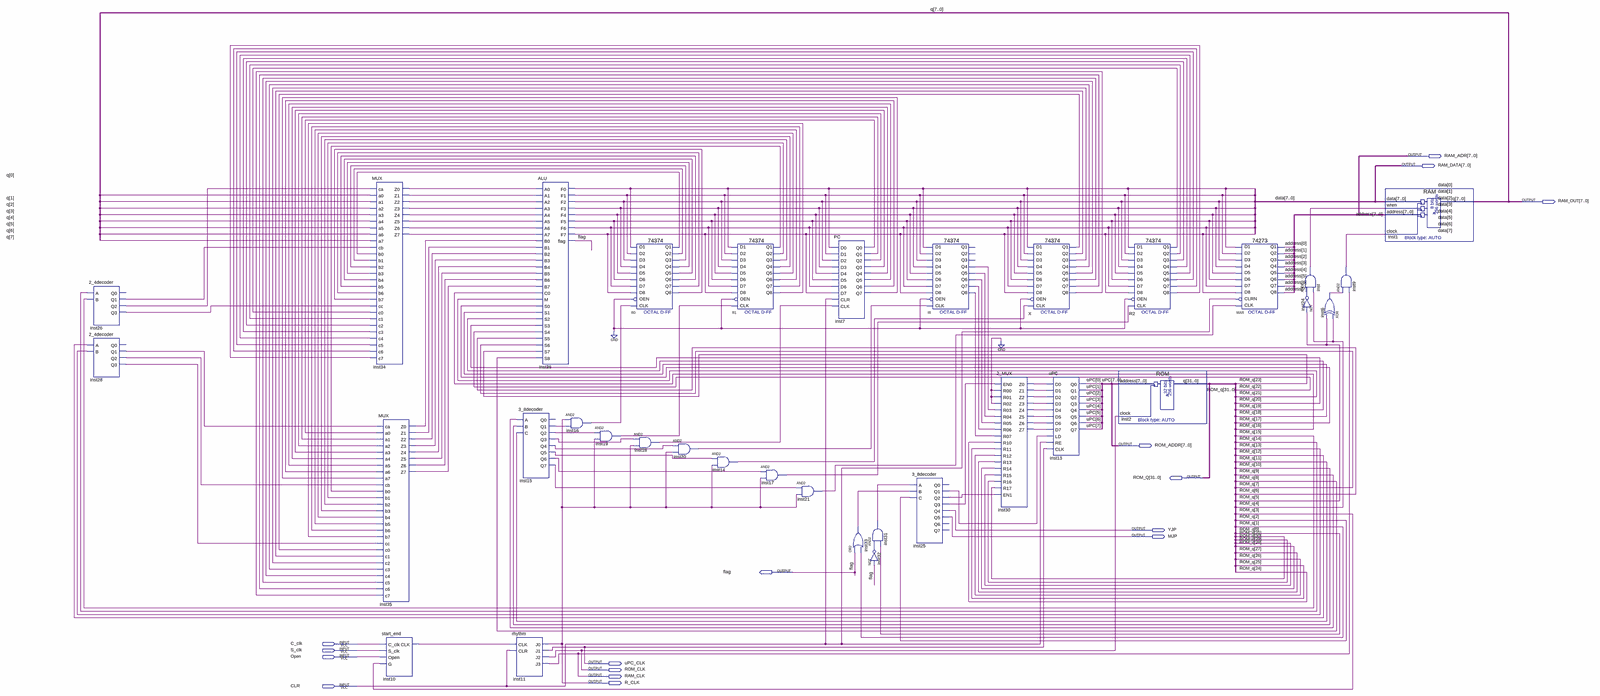
[diagram p0: schematic sheet, whole]
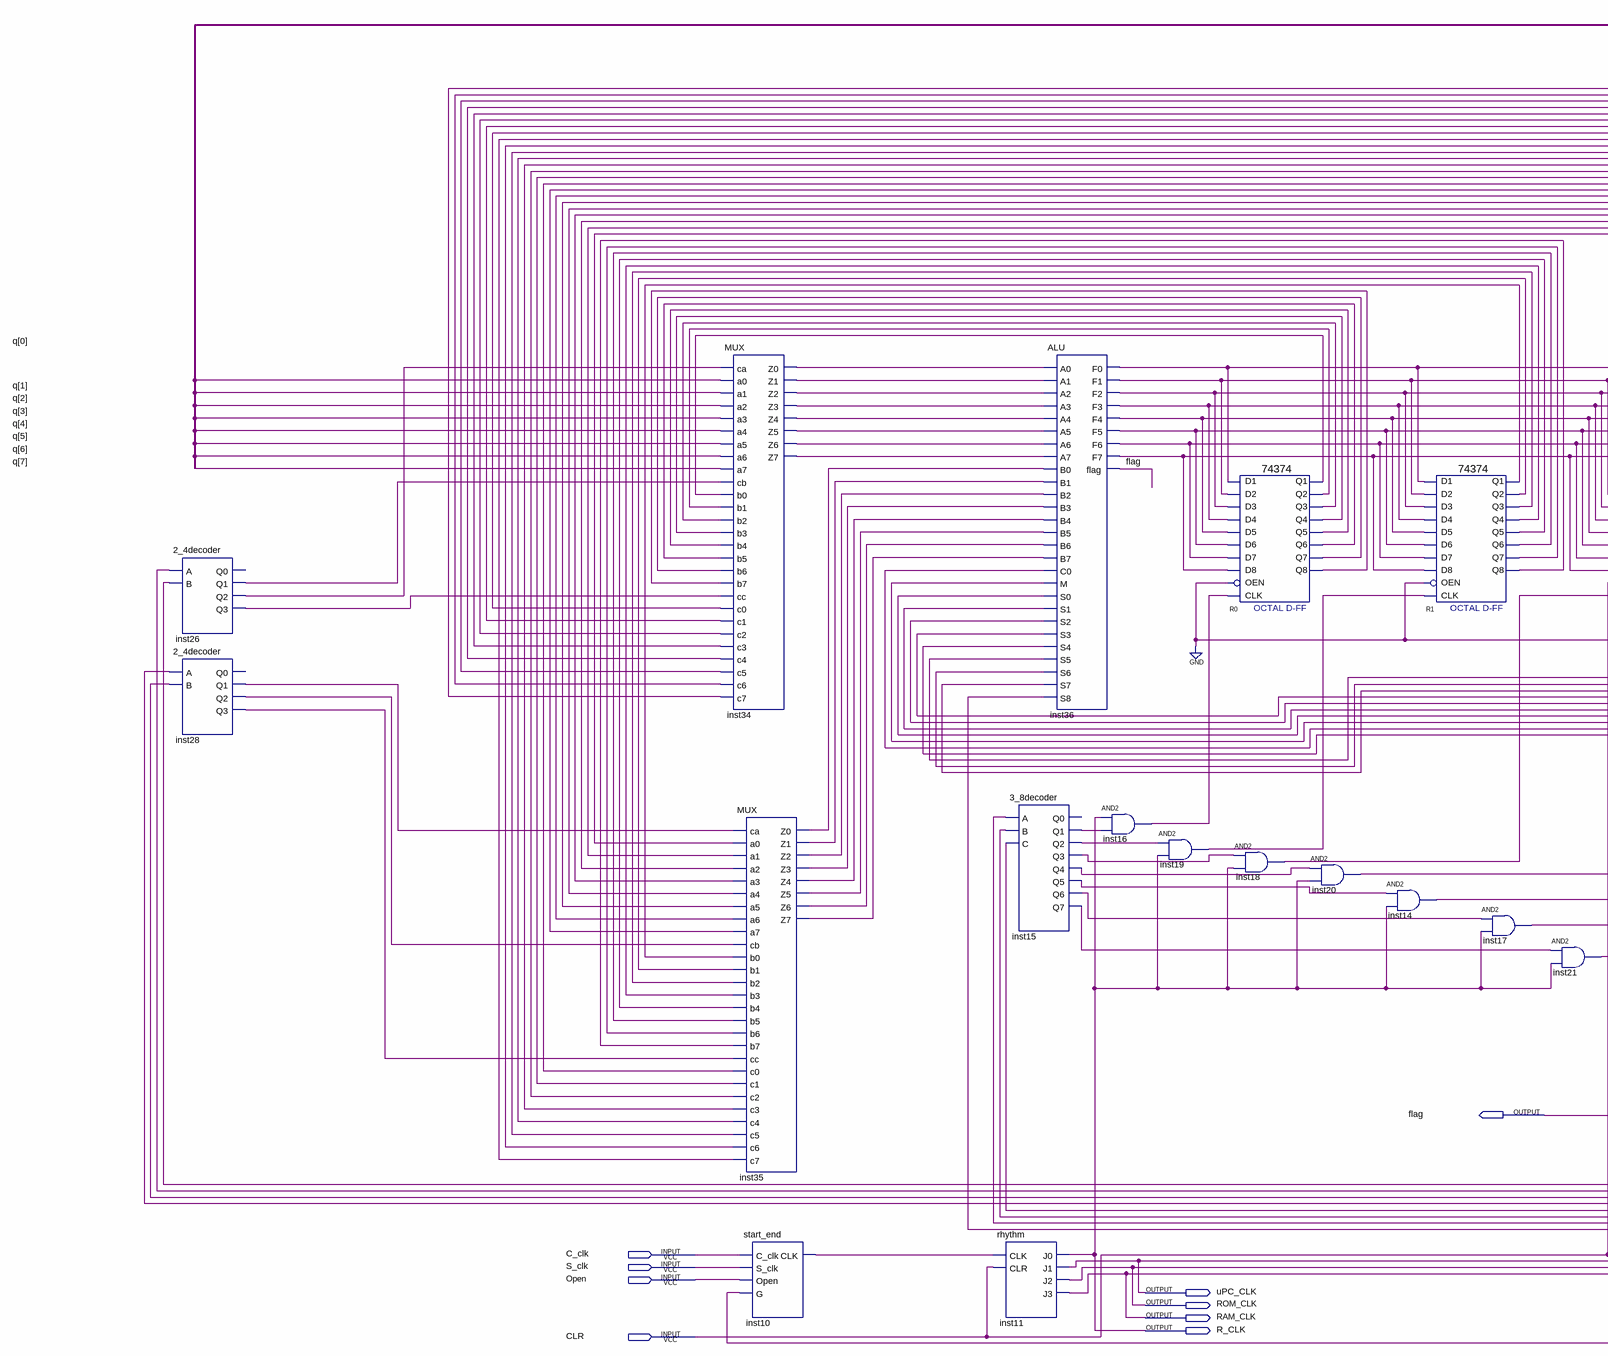
[diagram p1: schematic sheet, left part]
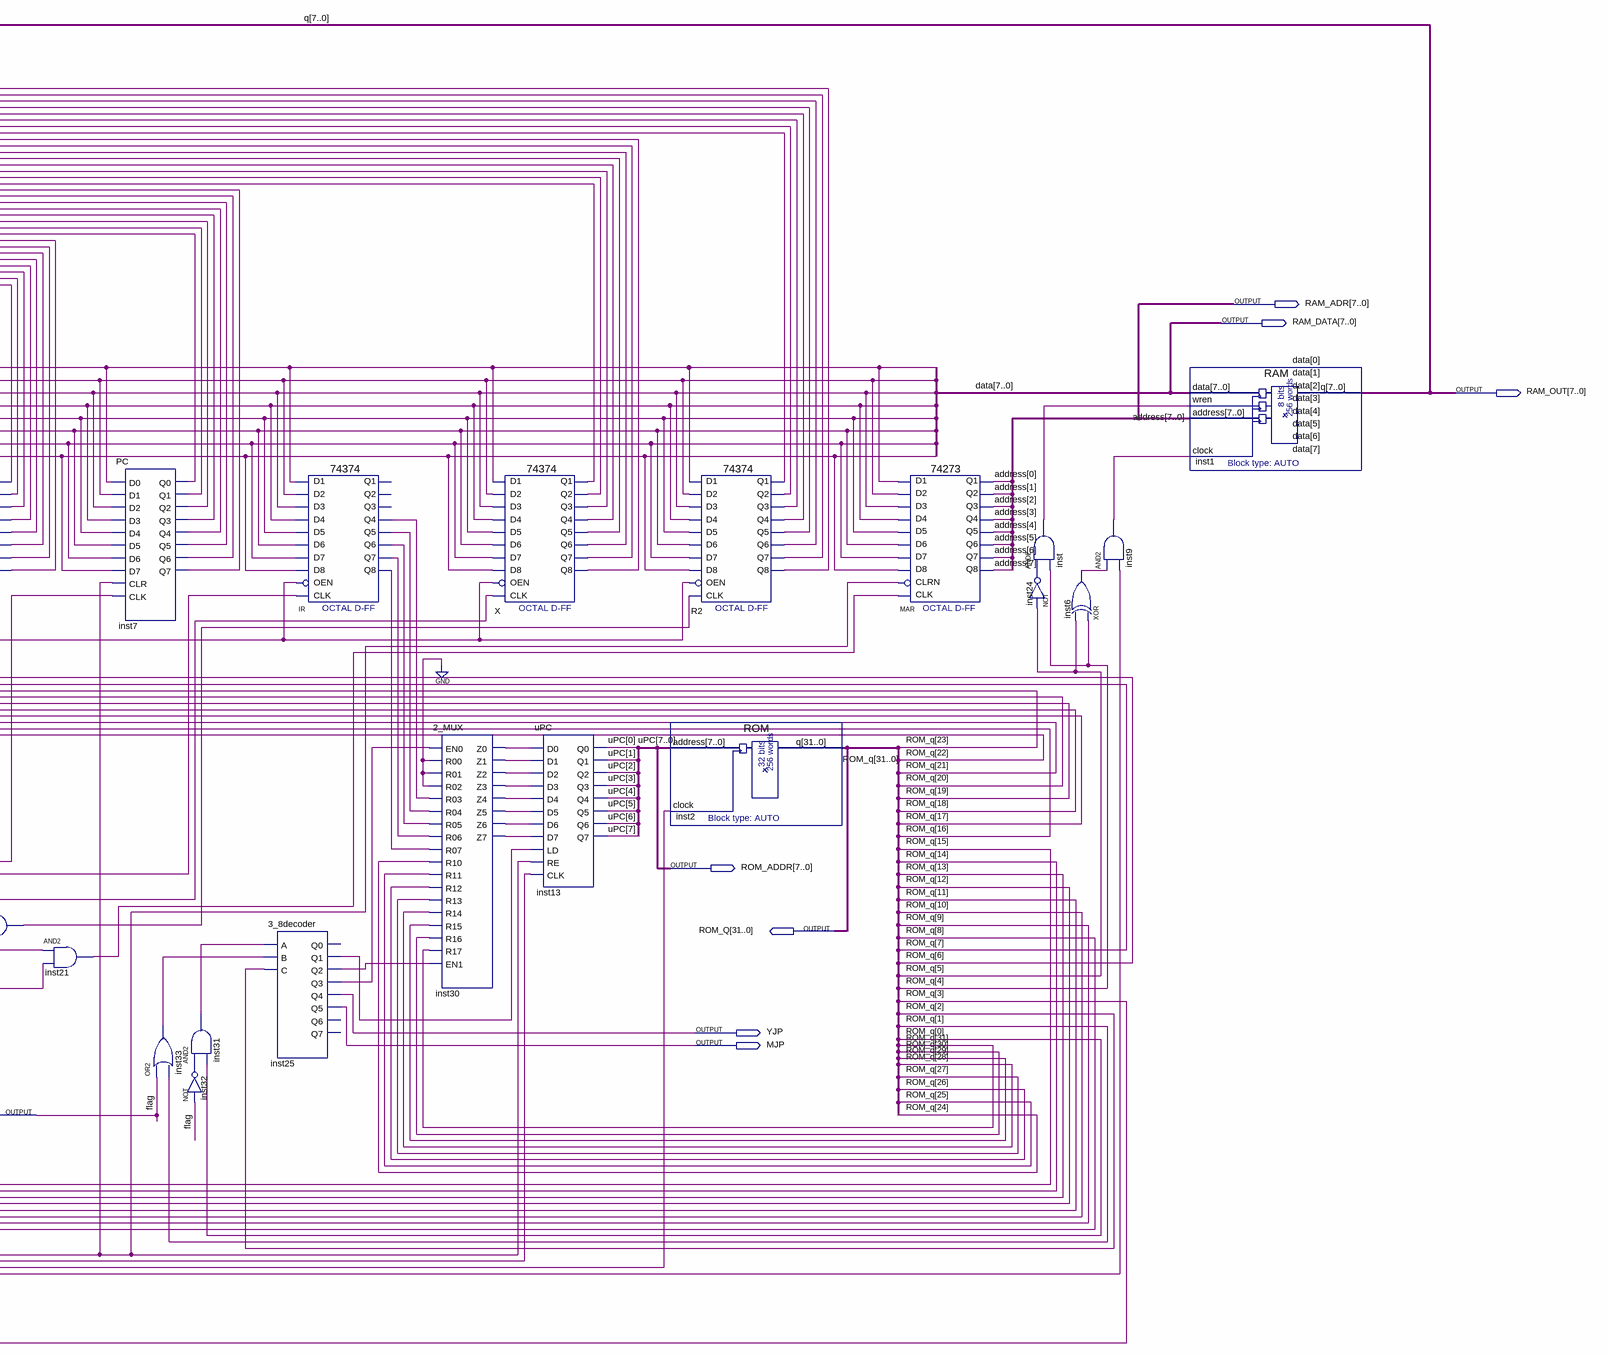
[diagram p2: schematic sheet, right part]
// Quartus schematic T3.bdf as structural Verilog: 34 symbols, 16 pins
module T3 (
  input  C_clk,
  input  S_clk,
  input  Open,
  input  CLR,
  output [7:0] RAM_ADR,
  output [7:0] RAM_DATA,
  output [7:0] RAM_OUT,
  output [7:0] ROM_ADDR,
  output [31:0] ROM_Q,
  output YJP,
  output MJP,
  output flag,
  output uPC_CLK,
  output ROM_CLK,
  output RAM_CLK,
  output R_CLK
);

  wire inst6_out, inst7_q0, inst7_q1, inst7_q2, inst7_q3, inst7_q4, inst7_q5, inst7_q6, inst7_q7, inst9_out,
       inst10_clk, inst14_out, inst15_q1, inst15_q2, inst15_q3, inst15_q4, inst15_q5, inst15_q6, inst15_q7,
       inst16_out, inst17_out, inst18_out, inst19_out, inst20_out, inst21_out, inst24_out, inst25_q1,
       inst25_q2, inst25_q3, inst26_q1, inst26_q2, inst26_q3, inst28_q1, inst28_q2, inst28_q3, inst30_z0,
       inst30_z1, inst30_z2, inst30_z3, inst30_z4, inst30_z5, inst30_z6, inst30_z7, inst31_out, inst32_out,
       inst33_out, inst34_z0, inst34_z1, inst34_z2, inst34_z3, inst34_z4, inst34_z5, inst34_z6, inst34_z7,
       inst35_z0, inst35_z1, inst35_z2, inst35_z3, inst35_z4, inst35_z5, inst35_z6, inst35_z7, inst_out,
       IR_q4, IR_q5, IR_q6, IR_q7, IR_q8, R0_q1, R0_q2, R0_q3, R0_q4, R0_q5, R0_q6, R0_q7, R0_q8, R1_q1,
       R1_q2, R1_q3, R1_q4, R1_q5, R1_q6, R1_q7, R1_q8, R2_q1, R2_q2, R2_q3, R2_q4, R2_q5, R2_q6, R2_q7,
       R2_q8, X_q1, X_q2, X_q3, X_q4, X_q5, X_q6, X_q7, X_q8;

  \2_4decoder  inst26 (.A(ROM_Q[14]), .B(ROM_Q[15]), .Q1(inst26_q1), .Q2(inst26_q2), .Q3(inst26_q3));  // open: Q0
  \2_4decoder  inst28 (.A(ROM_Q[12]), .B(ROM_Q[13]), .Q1(inst28_q1), .Q2(inst28_q2), .Q3(inst28_q3));  // open: Q0
  MUX inst34 (
    .ca(inst26_q2), .a0(RAM_OUT[0]), .a1(RAM_OUT[1]), .a2(RAM_OUT[2]), .a3(RAM_OUT[3]), .a4(RAM_OUT[4]),
    .a5(RAM_OUT[5]), .a6(RAM_OUT[6]), .a7(RAM_OUT[7]), .cb(inst26_q1), .b0(R0_q1), .b1(R0_q2), .b2(R0_q3),
    .b3(R0_q4), .b4(R0_q5), .b5(R0_q6), .b6(R0_q7), .b7(R0_q8), .cc(inst26_q3), .c0(R2_q1), .c1(R2_q2),
    .c2(R2_q3), .c3(R2_q4), .c4(R2_q5), .c5(R2_q6), .c6(R2_q7), .c7(R2_q8), .Z0(inst34_z0), .Z1(inst34_z1),
    .Z2(inst34_z2), .Z3(inst34_z3), .Z4(inst34_z4), .Z5(inst34_z5), .Z6(inst34_z6), .Z7(inst34_z7));
  MUX inst35 (
    .ca(inst28_q1), .a0(inst7_q0), .a1(inst7_q1), .a2(inst7_q2), .a3(inst7_q3), .a4(inst7_q4), .a5(inst7_q5),
    .a6(inst7_q6), .a7(inst7_q7), .cb(inst28_q2), .b0(R1_q1), .b1(R1_q2), .b2(R1_q3), .b3(R1_q4), .b4(R1_q5),
    .b5(R1_q6), .b6(R1_q7), .b7(R1_q8), .cc(inst28_q3), .c0(X_q1), .c1(X_q2), .c2(X_q3), .c3(X_q4),
    .c4(X_q5), .c5(X_q6), .c6(X_q7), .c7(X_q8), .Z0(inst35_z0), .Z1(inst35_z1), .Z2(inst35_z2),
    .Z3(inst35_z3), .Z4(inst35_z4), .Z5(inst35_z5), .Z6(inst35_z6), .Z7(inst35_z7));
  start_end inst10 (.C_clk(C_clk), .S_clk(S_clk), .Open(Open), .G(ROM_Q[3]), .CLK(inst10_clk));
  \3_8decoder  inst15 (
    .A(ROM_Q[9]), .B(ROM_Q[10]), .C(ROM_Q[11]), .Q1(inst15_q1), .Q2(inst15_q2), .Q3(inst15_q3),
    .Q4(inst15_q4), .Q5(inst15_q5), .Q6(inst15_q6), .Q7(inst15_q7));  // open: Q0
  rhythm inst11 (.CLK(inst10_clk), .CLR(CLR), .J0(R_CLK), .J1(uPC_CLK), .J2(ROM_CLK), .J3(RAM_CLK));
  ALU inst36 (
    .A0(inst34_z0), .A1(inst34_z1), .A2(inst34_z2), .A3(inst34_z3), .A4(inst34_z4), .A5(inst34_z5),
    .A6(inst34_z6), .A7(inst34_z7), .B0(inst35_z0), .B1(inst35_z1), .B2(inst35_z2), .B3(inst35_z3),
    .B4(inst35_z4), .B5(inst35_z5), .B6(inst35_z6), .B7(inst35_z7), .C0(ROM_Q[16]), .M(ROM_Q[21]),
    .S0(ROM_Q[17]), .S1(ROM_Q[18]), .S2(ROM_Q[19]), .S3(ROM_Q[20]), .S4(ROM_Q[22]), .S5(ROM_Q[6]),
    .S6(ROM_Q[7]), .S7(ROM_Q[23]), .S8(ROM_Q[8]), .F0(RAM_DATA[0]), .F1(RAM_DATA[1]), .F2(RAM_DATA[2]),
    .F3(RAM_DATA[3]), .F4(RAM_DATA[4]), .F5(RAM_DATA[5]), .F6(RAM_DATA[6]), .F7(RAM_DATA[7]), .flag(flag));
  and inst16 (inst16_out, R_CLK, inst15_q1);
  and inst19 (inst19_out, inst15_q2, R_CLK);
  \74374  R0 (
    .D1(RAM_DATA[0]), .D2(RAM_DATA[1]), .D3(RAM_DATA[2]), .D4(RAM_DATA[3]), .D6(RAM_DATA[5]),
    .D5(RAM_DATA[4]), .OEN(1'b0), .D8(RAM_DATA[7]), .D7(RAM_DATA[6]), .CLK(inst16_out), .Q2(R0_q2),
    .Q3(R0_q3), .Q5(R0_q5), .Q4(R0_q4), .Q6(R0_q6), .Q7(R0_q7), .Q8(R0_q8), .Q1(R0_q1));
  and inst18 (inst18_out, inst15_q3, R_CLK);
  and inst20 (inst20_out, inst15_q4, R_CLK);
  and inst14 (inst14_out, inst15_q5, R_CLK);
  \74374  R1 (
    .D1(RAM_DATA[0]), .D2(RAM_DATA[1]), .D3(RAM_DATA[2]), .D4(RAM_DATA[3]), .D6(RAM_DATA[5]),
    .D5(RAM_DATA[4]), .OEN(1'b0), .D8(RAM_DATA[7]), .D7(RAM_DATA[6]), .CLK(inst19_out), .Q2(R1_q2),
    .Q3(R1_q3), .Q5(R1_q5), .Q4(R1_q4), .Q6(R1_q6), .Q7(R1_q7), .Q8(R1_q8), .Q1(R1_q1));
  and inst17 (inst17_out, inst15_q6, R_CLK);
  and inst21 (inst21_out, inst15_q7, R_CLK);
  PC inst7 (
    .D0(RAM_DATA[0]), .D1(RAM_DATA[1]), .D2(RAM_DATA[2]), .D3(RAM_DATA[3]), .D4(RAM_DATA[4]),
    .D5(RAM_DATA[5]), .D6(RAM_DATA[6]), .D7(RAM_DATA[7]), .CLR(CLR), .CLK(inst18_out), .Q0(inst7_q0),
    .Q1(inst7_q1), .Q2(inst7_q2), .Q3(inst7_q3), .Q4(inst7_q4), .Q5(inst7_q5), .Q6(inst7_q6), .Q7(inst7_q7));
  or inst33 (inst33_out, flag, ROM_Q[1]);
  and inst31 (inst31_out, inst32_out, ROM_Q[0]);
  not inst32 (inst32_out, flag);
  \3_8decoder  inst25 (
    .A(inst31_out), .B(inst33_out), .C(ROM_Q[2]), .Q1(inst25_q1), .Q2(inst25_q2), .Q3(inst25_q3), .Q4(YJP),
    .Q5(MJP));  // open: Q0, Q6, Q7
  \74374  IR (
    .D1(RAM_DATA[0]), .D2(RAM_DATA[1]), .D3(RAM_DATA[2]), .D4(RAM_DATA[3]), .D6(RAM_DATA[5]),
    .D5(RAM_DATA[4]), .OEN(1'b0), .D8(RAM_DATA[7]), .D7(RAM_DATA[6]), .CLK(inst20_out), .Q5(IR_q5),
    .Q4(IR_q4), .Q6(IR_q6), .Q7(IR_q7), .Q8(IR_q8));  // open: Q2, Q3, Q1
  \2_MUX  inst30 (
    .EN0(inst25_q3), .R00(1'b0), .R01(1'b0), .R02(1'b0), .R03(IR_q4), .R04(IR_q5), .R05(IR_q6), .R06(IR_q7),
    .R07(IR_q8), .R10(ROM_Q[24]), .R11(ROM_Q[25]), .R12(ROM_Q[26]), .R13(ROM_Q[27]), .R14(ROM_Q[28]),
    .R15(ROM_Q[29]), .R16(ROM_Q[30]), .R17(ROM_Q[31]), .EN1(inst25_q2), .Z0(inst30_z0), .Z1(inst30_z1),
    .Z2(inst30_z2), .Z3(inst30_z3), .Z4(inst30_z4), .Z5(inst30_z5), .Z6(inst30_z6), .Z7(inst30_z7));
  \74374  X (
    .D1(RAM_DATA[0]), .D2(RAM_DATA[1]), .D3(RAM_DATA[2]), .D4(RAM_DATA[3]), .D6(RAM_DATA[5]),
    .D5(RAM_DATA[4]), .OEN(1'b0), .D8(RAM_DATA[7]), .D7(RAM_DATA[6]), .CLK(inst14_out), .Q2(X_q2), .Q3(X_q3),
    .Q5(X_q5), .Q4(X_q4), .Q6(X_q6), .Q7(X_q7), .Q8(X_q8), .Q1(X_q1));
  uPC inst13 (
    .D0(inst30_z0), .D1(inst30_z1), .D2(inst30_z2), .D3(inst30_z3), .D4(inst30_z4), .D5(inst30_z5),
    .D6(inst30_z6), .D7(inst30_z7), .LD(inst25_q1), .RE(CLR), .CLK(uPC_CLK), .Q0(ROM_ADDR[0]),
    .Q1(ROM_ADDR[1]), .Q2(ROM_ADDR[2]), .Q3(ROM_ADDR[3]), .Q4(ROM_ADDR[4]), .Q5(ROM_ADDR[5]),
    .Q6(ROM_ADDR[6]), .Q7(ROM_ADDR[7]));
  ROM inst2 (.address(ROM_ADDR), .clock(ROM_CLK), .q(ROM_Q));
  \74374  R2 (
    .D1(RAM_DATA[0]), .D2(RAM_DATA[1]), .D3(RAM_DATA[2]), .D4(RAM_DATA[3]), .D6(RAM_DATA[5]),
    .D5(RAM_DATA[4]), .OEN(1'b0), .D8(RAM_DATA[7]), .D7(RAM_DATA[6]), .CLK(inst17_out), .Q2(R2_q2),
    .Q3(R2_q3), .Q5(R2_q5), .Q4(R2_q4), .Q6(R2_q6), .Q7(R2_q7), .Q8(R2_q8), .Q1(R2_q1));
  \74273  MAR (
    .D2(RAM_DATA[1]), .D3(RAM_DATA[2]), .D1(RAM_DATA[0]), .D4(RAM_DATA[3]), .D7(RAM_DATA[6]),
    .D6(RAM_DATA[5]), .D5(RAM_DATA[4]), .D8(RAM_DATA[7]), .CLK(inst21_out), .CLRN(CLR), .Q4(RAM_ADR[3]),
    .Q1(RAM_ADR[0]), .Q2(RAM_ADR[1]), .Q3(RAM_ADR[2]), .Q6(RAM_ADR[5]), .Q5(RAM_ADR[4]), .Q7(RAM_ADR[6]),
    .Q8(RAM_ADR[7]));
  and inst (inst_out, inst24_out, ROM_Q[4]);
  not inst24 (inst24_out, ROM_Q[5]);
  xor inst6 (inst6_out, ROM_Q[4], ROM_Q[5]);
  and inst9 (inst9_out, inst6_out, RAM_CLK);
  RAM inst1 (.data(RAM_DATA), .wren(inst_out), .address(RAM_ADR), .clock(inst9_out), .q(RAM_OUT));

  // Other names for the same wires on the sheet: data[7:0] = RAM_DATA; q[7:0] = RAM_OUT; address[7:0] = RAM_ADR;
  //   uPC[7:0] = ROM_ADDR
endmodule
